# Altium schematic sheet 01 - ST-LINK V2.1.SchDoc
size A4
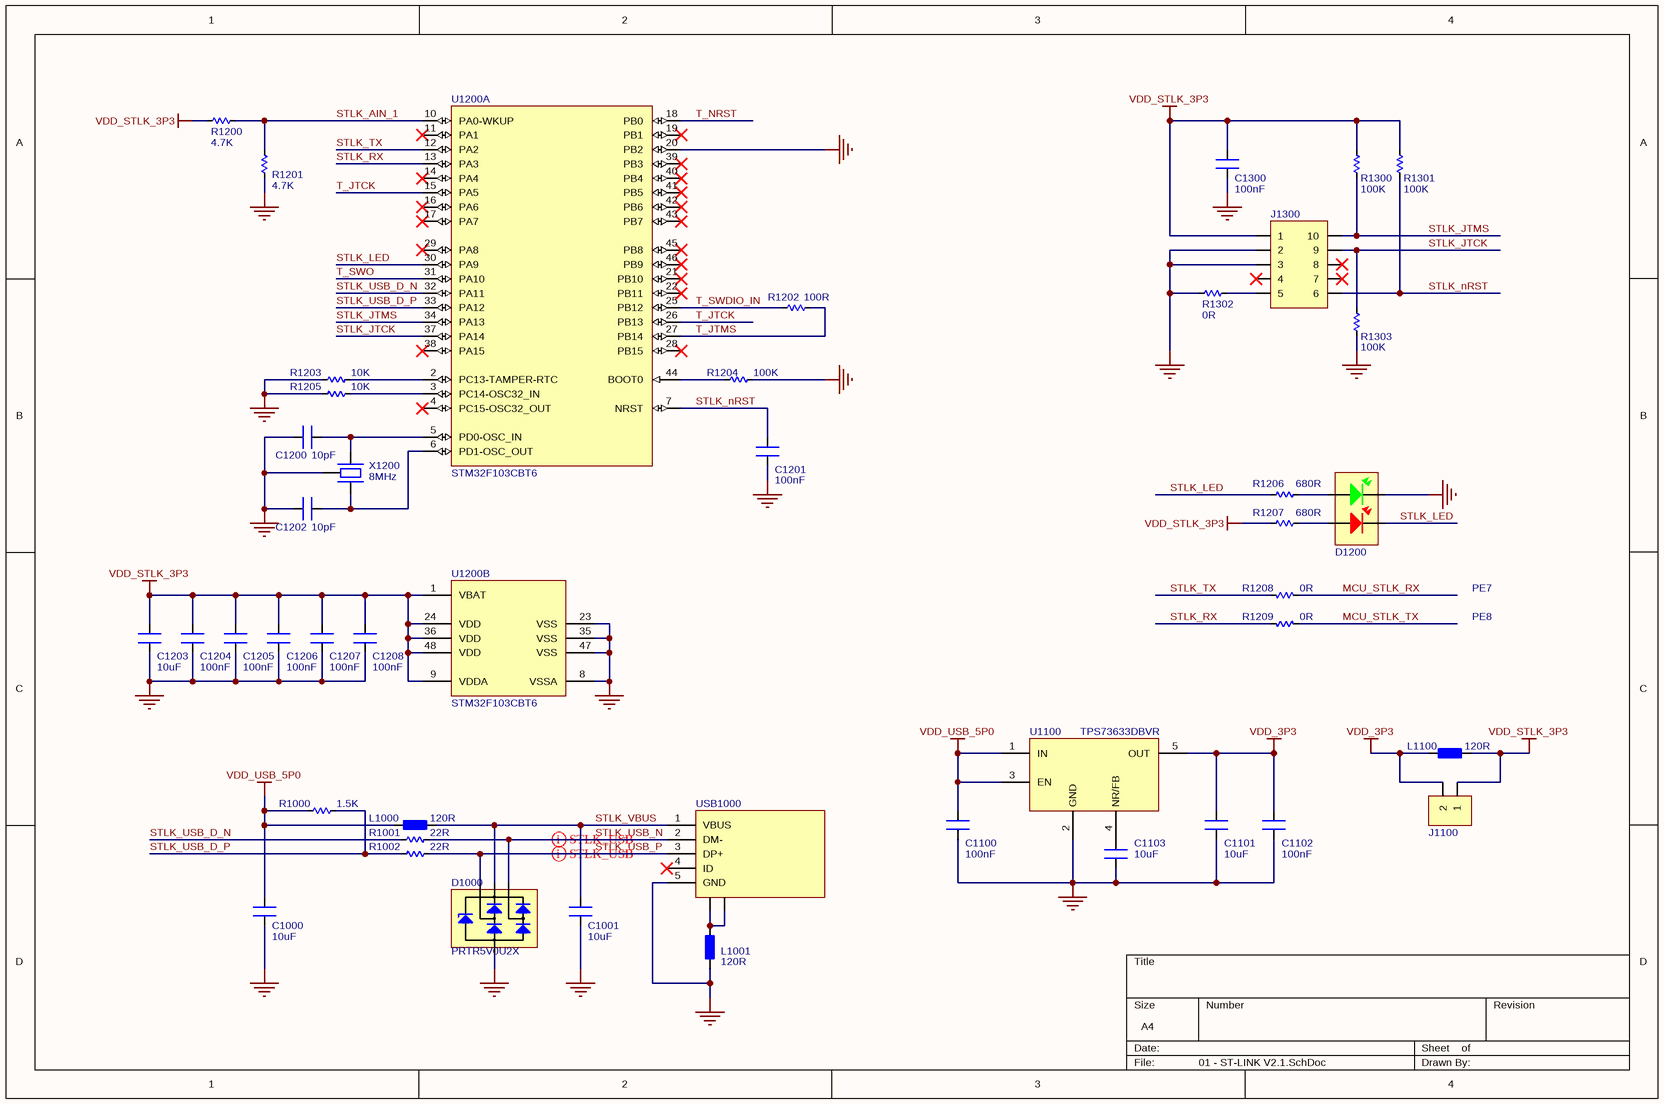
[diagram p0: 01 - ST-LINK V2.1.SchDoc]

## Parts
C1000  value 10uF  [CN-SMD-0603]  (hidden comment: Capacitor)
C1001  value 10uF  [CN-SMD-0603]  (hidden comment: Capacitor)
C1100  value 100nF  [CN-SMD-0603]  (hidden comment: Capacitor)
C1101  value 10uF  [CN-SMD-0603]  (hidden comment: Capacitor)
C1102  value 100nF  [CN-SMD-0603]  (hidden comment: Capacitor)
C1103  value 10uF  [CN-SMD-0603]  (hidden comment: Capacitor)
C1200  value 10pF  [CN-SMD-0402]  (hidden comment: Capacitor)
C1201  value 100nF  [CN-SMD-0402]  (hidden comment: Capacitor)
C1202  value 10pF  [CN-SMD-0402]  (hidden comment: Capacitor)
C1203  value 10uF  [CN-SMD-0603]  (hidden comment: Capacitor)
C1204  value 100nF  [CN-SMD-0402]  (hidden comment: Capacitor)
C1205  value 100nF  [CN-SMD-0402]  (hidden comment: Capacitor)
C1206  value 100nF  [CN-SMD-0402]  (hidden comment: Capacitor)
C1207  value 100nF  [CN-SMD-0402]  (hidden comment: Capacitor)
C1208  value 100nF  [CN-SMD-0402]  (hidden comment: Capacitor)
C1300  value 100nF  [CN-SMD-0402]  (hidden comment: Capacitor)
D1000  PRTR5V0U2X  [SOT-143]
D1200  LED  [LED-SMD-1615M-RG]  (value not drawn)
J1100  JP2  [JP2-D1T]  (value not drawn)
J1300  Terminal strip  [JP1.27-10P]  (value not drawn)
L1000  value 120R  [L-SMD-0603]  (hidden comment: Ferrite bead)
L1001  value 120R  [L-SMD-0603]  (hidden comment: Ferrite bead)
L1100  value 120R  [L-SMD-0402]  (hidden comment: Ferrite bead)
R1000  value 1.5K  [RES-SMD-0402]  (hidden comment: Resistor)
R1001  value 22R  [RES-SMD-0402]  (hidden comment: Resistor)
R1002  value 22R  [RES-SMD-0402]  (hidden comment: Resistor)
R1200  value 4.7K  [RES-SMD-0402]  (hidden comment: Resistor)
R1201  value 4.7K  [RES-SMD-0402]  (hidden comment: Resistor)
R1202  value 100R  [RES-SMD-0402]  (hidden comment: Resistor)
R1203  value 10K  [RES-SMD-0402]  (hidden comment: Resistor)
R1204  value 100K  [RES-SMD-0402]  (hidden comment: Resistor)
R1205  value 10K  [RES-SMD-0402]  (hidden comment: Resistor)
R1206  value 680R  [RES-SMD-0402]  (hidden comment: Resistor)
R1207  value 680R  [RES-SMD-0402]  (hidden comment: Resistor)
R1208  value 0R  [RES-SMD-0402]  (hidden comment: Resistor)
R1209  value 0R  [RES-SMD-0402]  (hidden comment: Resistor)
R1300  value 100K  [RES-SMD-0402]  (hidden comment: Resistor)
R1301  value 100K  [RES-SMD-0402]  (hidden comment: Resistor)
R1302  value 0R  [RES-SMD-0402]  (hidden comment: Resistor)
R1303  value 100K  [RES-SMD-0402]  (hidden comment: Resistor)
U1100  TPS73633DBVR  [SOT-23-5]
U1200  STM32F103CBT6  [LQFP50P900X900X160-48N]  (parts A,B of 2)
USB1000  USB  [USB_micro-B_F_SMD-2]  (value not drawn)
X1200  Frequency: 8MHz  [XT-SMD-3213M-3P]  (hidden comment: Crystal)

## Nets
GND: C1000.1 C1001.1 C1100.1 C1101.1 C1102.1 C1103.1 C1200.2 C1201.1 C1202.2 C1203.1 C1204.1 C1205.1 C1206.1 C1207.1 C1208.1 C1300.1 D1000.1(GND) D1200.2(GREEN_CN) J1300.2 J1300.3 L1001.1 R1201.2 R1203.2 R1204.1 R1205.2 R1302.2 R1303.2 U1100.2(GND) U1200.8(VSSA) U1200.20(PB2) U1200.23(VSS) U1200.35(VSS) U1200.47(VSS) USB1000.5(GND) X1200.3
VDD_3P3: C1101.2 C1102.2 J1100.2 L1100.2 U1100.5(OUT)
VDD_STLK_3P3: C1203.2 C1204.2 C1205.2 C1206.2 C1207.2 C1208.2 C1300.2 J1100.1 J1300.1 L1100.1 R1200.2 R1207.2 R1300.1 R1301.1 U1200.1(VBAT) U1200.9(VDDA) U1200.24(VDD) U1200.36(VDD) U1200.48(VDD)
VDD_USB_5P0: C1000.2 C1100.2 L1000.2 R1000.2 U1100.1(IN) U1100.3(EN)
MCU_STLK_RX: R1208.1
MCU_STLK_TX: R1209.1
STLK_AIN_1: R1200.1 R1201.1 U1200.10(PA0-WKUP)
STLK_JTCK: J1300.9 R1303.1 U1200.37(PA14)
STLK_JTMS: J1300.10 R1300.2 U1200.34(PA13)
STLK_LED: D1200.1(RED_CN) R1206.2 U1200.30(PA9)
STLK_nRST: C1201.2 J1300.6 R1301.2 U1200.7(NRST)
STLK_RX: R1209.2 U1200.13(PA3)
STLK_TX: R1208.2 U1200.12(PA2)
STLK_USB_D_N: R1001.2 U1200.32(PA11)
STLK_USB_D_P: R1000.1 R1002.2 U1200.33(PA12)
STLK_USB_N: D1000.3 R1001.1 USB1000.2(DM-)
STLK_USB_P: D1000.2 R1002.1 USB1000.3(DP+)
STLK_VBUS: C1001.2 D1000.4(VDD) L1000.1 USB1000.1(VBUS)
T_JTCK: U1200.15(PA5) U1200.26(PB13)
T_JTMS: R1202.1 U1200.27(PB14)
T_NRST: U1200.18(PB0)
T_SWDIO_IN: R1202.2 U1200.25(PB12)
T_SWO: U1200.31(PA10)
NetC1103_2: C1103.2 U1100.4(NR/FB)
NetC1200_1: C1200.1 U1200.5(PD0-OSC_IN) X1200.1
NetC1202_1: C1202.1 U1200.6(PD1-OSC_OUT) X1200.2
NetD1200_3: D1200.3(GREEN_AN) R1206.1
NetD1200_4: D1200.4(RED_AN) R1207.1
NetJ1300_5: J1300.5 R1302.1
NetL1001_2: L1001.2 USB1000.0
NetR1203_1: R1203.1 U1200.2(PC13-TAMPER-RTC)
NetR1204_2: R1204.2 U1200.44(BOOT0)
NetR1205_1: R1205.1 U1200.3(PC14-OSC32_IN)

Not connected (* = marked no-connect by the designer): J1300 4* 7* 8*; U1200 4(PC15-OSC32_OUT)* 11(PA1)* 14(PA4)* 16(PA6)* 17(PA7)* 19(PB1)* 21(PB10)* 22(PB11)* 28(PB15)* 29(PA8)* 38(PA15)* 39(PB3)* 40(PB4)* 41(PB5)* 42(PB6)* 43(PB7)* 45(PB8)* 46(PB9)*; USB1000 4(ID)*

## Layout directives
differential pair; differential pair class STLK_USB: STLK_USB_N, STLK_USB_P

## Notes on the sheet
- PE7
- PE8

## Library data of the parts
C1000 C1001 C1101 C1103 C1203 = Cap: Ceramic Capacitor SMD 0603 10uF ±20% 10V
C1100 C1102 = Cap: Ceramic Capacitor SMD 0603 100nF ±20% 50V
C1200 C1202 = Cap: Ceramic Capacitor SMD 0402 10pF ±20% 50V
C1201 C1204-C1208 C1300 = Cap: Ceramic Capacitor SMD 0402 100nF ±20% 16V
D1000 = PRTR5V0U2X: Ultra low capacitance double rail-to-rail ESD protection diode
D1200 = LED RG: LED bicolor red green SMD-1615
J1100 = JP2: Single 2-pin jumper
J1300 = JP5x2: Terminal strip 5-pin 2-row pitch 0.05" (1.27mm) SMD straight
L1000 L1001 = Ferrite bead: Ferrite bead SMD 0603 120 Ohm @100MHz
L1100 = Ferrite bead: Ferrite bead SMD 0402 120 Ohm @100MHz
R1000 = Res: Resistor SMD 0402 1.5K 1% 0.063W
R1001 R1002 = Res: Resistor SMD 0402 22R 1% 0.063W
R1200 R1201 = Res: Resistor SMD 0402 4.7K 1% 0.063W
R1202 = Res: Resistor SMD 0402 100R 1% 0.063W
R1203 R1205 = Res: Resistor SMD 0402 10K 1% 0.063W
R1204 R1300 R1301 R1303 = Res: Resistor SMD 0402 100K 1% 0.063W
R1206 R1207 = Res: Resistor SMD 0402 680R 1% 0.063W
R1208 R1209 R1302 = Res: Resistor SMD 0402 0R 1% 0.063W
U1100 = TPS73633DBVR: Cap-Free, NMOS, 400-mA Low-Dropout Regulator with Reverse Current Protection
U1200 = STM32F103CBT6: ARM Cortex-M3 32-bit MCU, 128 KB Flash, 20 KB Internal RAM, 37 I/Os, 48-pin LQFP, -40 to 85 degC, Tray; A/D Converter: 2x12-bit (10 Channel); FLASH Size (Prog) (kB): 128; I/Os (High Current): 37; Internal RAM Size (kB): 20; Operating Frequency(F) (Processor speed) (MHz): 72; Supply Voltage(Vcc) min (V): 2; DatasheetVersion: Rev. 16; PackageVersion: Rev. 6, 06/2013; PackageReference: LQFP48; PackageDescription: 48-Pin Low Profile Quad Flat Package, 7 x 7 mm Body, 0.5 mm Pitch; Supplier 1: Digi-Key; Supplier Part Number 1: 497-6288-ND; Supplier 2: Farnell; Supplier Part Number 2: 1606327; Supplier 3: Newark; Supplier Part Number 3: 11N8296; Supplier 4: Newark; Supplier Part Number 4: 57P1214; Supplier 5: Mouser; Supplier Part Number 5: 511-STM32F103CBT6; Core: ARM Cortex-M3; Packing: Tray; Mounting Technology: Surface Mount; PartNumber: STM32F103CBT6; ComponentLink1Description: Manufacturer URL; ComponentLink1URL: http://www.st.com/web/en/home.html; ComponentLink2Description: Datasheet; ComponentLink2URL: http://www.st.com/st-web-ui/static/active/en/resource/technical/document/datasheet/CD00161566.pdf; ComponentLink3Description: Package Specification; ComponentLink3URL: http://www.st.com/st-web-ui/static/active/en/resource/technical/document/datasheet/DM00058181.pdf
USB1000 = USB-5: USB female SMD micro-B type
X1200 = XT3: Crystal Oscillator SMD-3123 8MHz 3-pin